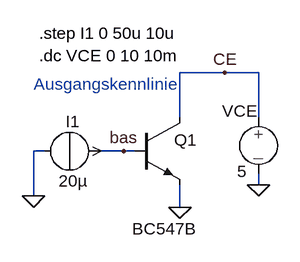
[diagram p0: schematic Q1-ausgangskennlinie.asc]
Q1-ausgangskennlinie.asc, the LTspice schematic file:
Version 4
SHEET 1 880 680
WIRE 288 64 224 64
WIRE 336 64 288 64
WIRE 224 128 224 64
WIRE 336 128 336 64
WIRE 32 176 16 176
WIRE 144 176 112 176
WIRE 160 176 144 176
WIRE 336 224 336 208
WIRE 16 240 16 176
WIRE 224 256 224 224
FLAG 224 256 0
FLAG 336 224 0
FLAG 288 64 CE
FLAG 144 176 bas
FLAG 16 240 0
SYMBOL EIT_Semiconductors\\npn 160 128 R0
WINDOW 3 -4 159 Left 2
SYMATTR InstName Q1
SYMATTR Value BC547B
SYMBOL source-V 336 112 R0
WINDOW 0 -52 7 Left 2
WINDOW 3 -30 93 Left 2
SYMATTR InstName VCE
SYMATTR Value 5
SYMBOL source-I 112 176 R90
WINDOW 0 -27 40 VBottom 2
WINDOW 3 27 40 VTop 2
SYMATTR InstName I1
SYMATTR Value 20µ
TEXT 16 80 Left 2 ;Ausgangskennlinie
TEXT 24 40 Left 2 !.dc VCE 0 10 10m
TEXT 24 8 Left 2 !.step I1 0 50u 10u

The netlist it stands for:
* Q1-ausgangskennlinie.asc
Q1 CE bas 0 0 BC547B
VCE CE 0 5
I1 0 bas 20µ
.model NPN NPN
.model PNP PNP
.lib standard.bjt
* Ausgangskennlinie
.dc VCE 0 10 10m
.step I1 0 50u 10u
.backanno
.end